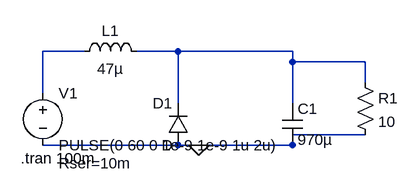
[diagram p0: schematic BuckConverter_IDKWhy.asc]
BuckConverter_IDKWhy.asc, the LTspice schematic file:
Version 4
SHEET 1 880 680
WIRE 144 80 80 80
WIRE 288 80 224 80
WIRE 464 80 288 80
WIRE 464 96 464 80
WIRE 576 96 464 96
WIRE 576 128 576 96
WIRE 80 144 80 80
WIRE 288 160 288 80
WIRE 464 160 464 96
WIRE 576 208 464 208
WIRE 288 224 80 224
WIRE 320 224 288 224
WIRE 464 224 464 208
WIRE 464 224 320 224
FLAG 320 224 0
SYMBOL voltage 80 128 R0
WINDOW 123 0 0 Left 0
WINDOW 39 24 124 Left 2
SYMATTR InstName V1
SYMATTR Value PULSE(0 60 0 1e-9 1e-9 1u 2u)
SYMATTR SpiceLine Rser=10m
SYMBOL ind 128 96 R270
WINDOW 0 32 56 VTop 2
WINDOW 3 5 56 VBottom 2
SYMATTR InstName L1
SYMATTR Value 47µ
SYMBOL diode 304 224 R180
WINDOW 0 24 64 Left 2
WINDOW 3 24 0 Left 2
SYMATTR InstName D1
SYMBOL cap 448 160 R0
SYMATTR InstName C1
SYMATTR Value 970µ
SYMATTR SpiceLine Rser=0.3u
SYMBOL res 560 112 R0
SYMATTR InstName R1
SYMATTR Value 10
TEXT 46 244 Left 2 !.tran 100m

The netlist it stands for:
* BuckConverter_IDKWhy.asc
V1 N001 0 PULSE(0 60 0 1e-9 1e-9 1u 2u) Rser=10m
L1 N001 N002 47µ
D1 0 N002 D
C1 N002 0 970µ Rser=0.3u
R1 N002 0 10
.model D D
.lib standard.dio
.tran 100m
.backanno
.end